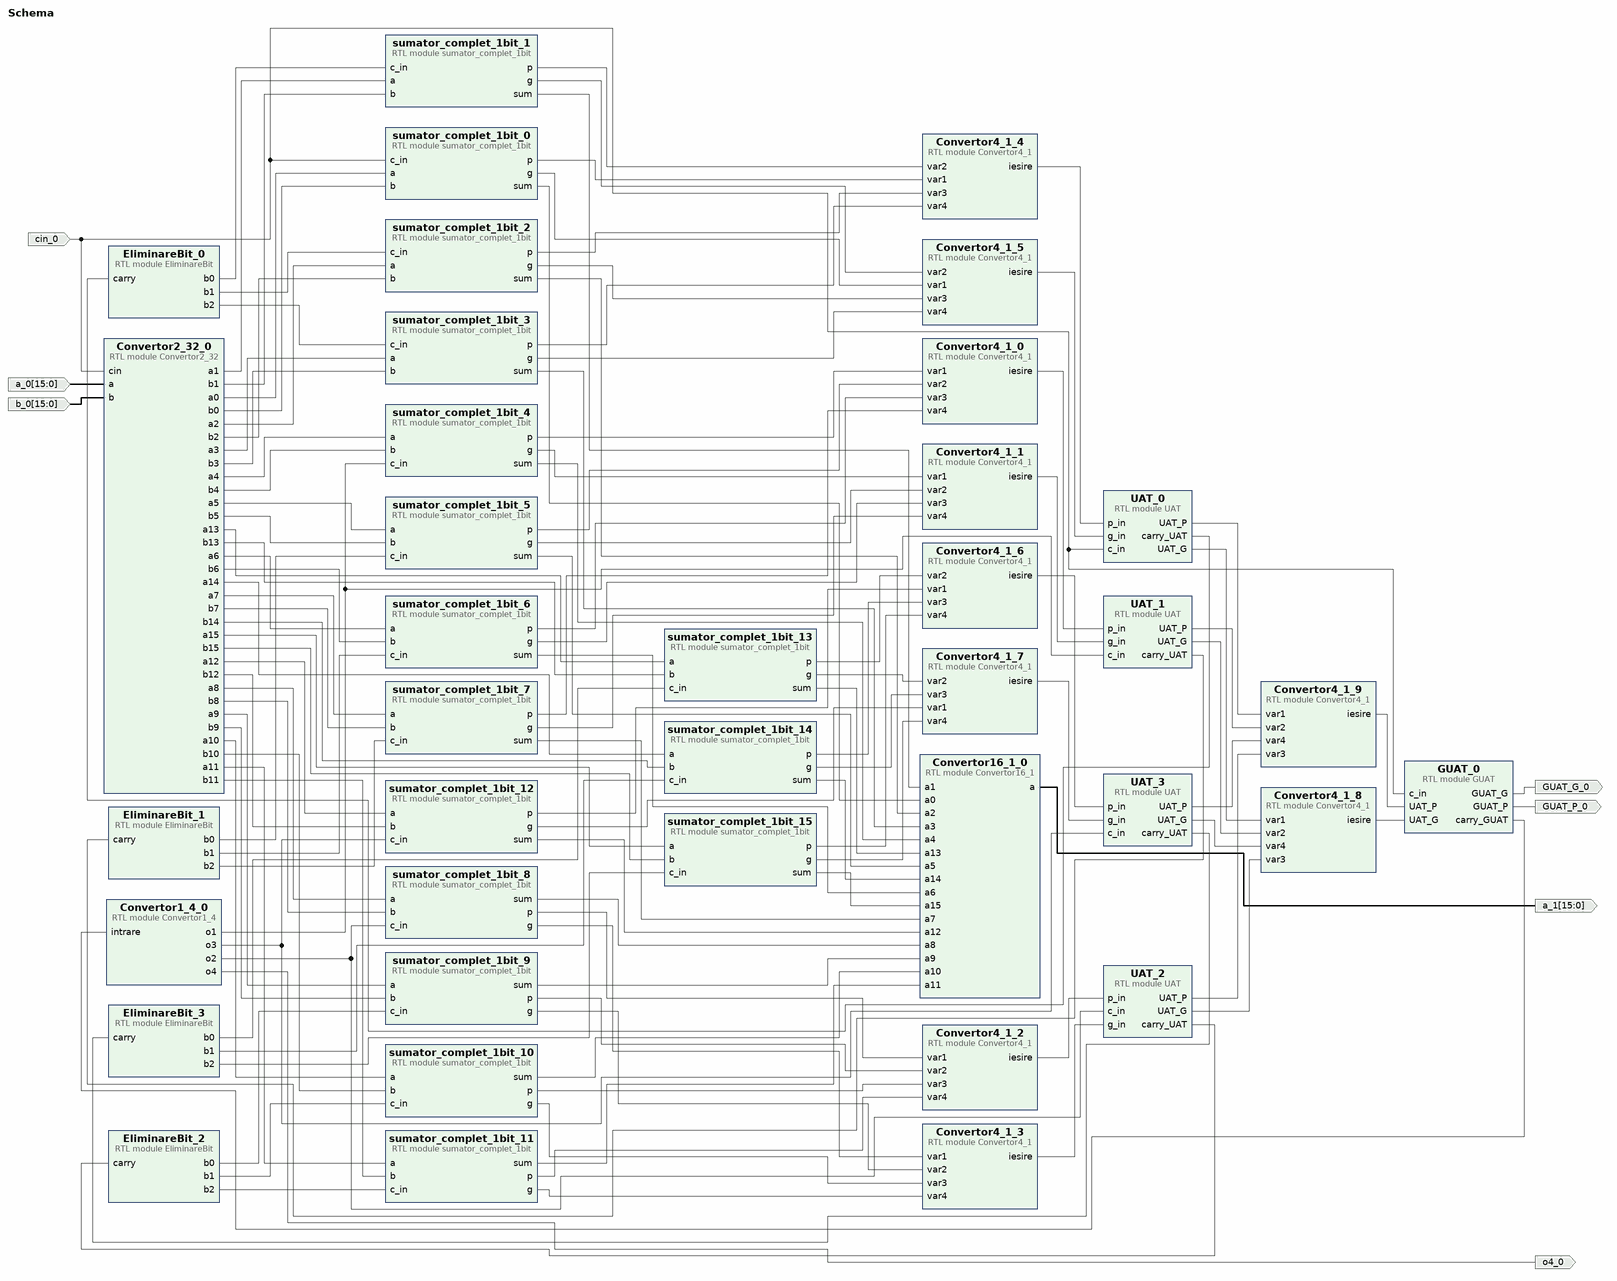
[diagram p0: block diagram of the top level]
# Vivado block design Schema, xc7a100tcsg324-1, Vivado 2020.2
create_bd_design Schema

create_bd_port -dir I -from 15 -to 0 a_0
create_bd_port -dir I -from 15 -to 0 b_0
create_bd_port -dir I cin_0
create_bd_port -dir O GUAT_G_0
create_bd_port -dir O GUAT_P_0
create_bd_port -dir O o4_0
create_bd_port -dir O -from 15 -to 0 a_1

create_bd_cell -type module -reference sumator_complet_1bit sumator_complet_1bit_0
create_bd_cell -type module -reference sumator_complet_1bit sumator_complet_1bit_1
create_bd_cell -type module -reference sumator_complet_1bit sumator_complet_1bit_2
create_bd_cell -type module -reference sumator_complet_1bit sumator_complet_1bit_3
create_bd_cell -type module -reference sumator_complet_1bit sumator_complet_1bit_4
create_bd_cell -type module -reference sumator_complet_1bit sumator_complet_1bit_5
create_bd_cell -type module -reference sumator_complet_1bit sumator_complet_1bit_6
create_bd_cell -type module -reference sumator_complet_1bit sumator_complet_1bit_7
create_bd_cell -type module -reference sumator_complet_1bit sumator_complet_1bit_8
create_bd_cell -type module -reference sumator_complet_1bit sumator_complet_1bit_9
create_bd_cell -type module -reference sumator_complet_1bit sumator_complet_1bit_10
create_bd_cell -type module -reference sumator_complet_1bit sumator_complet_1bit_11
create_bd_cell -type module -reference sumator_complet_1bit sumator_complet_1bit_12
create_bd_cell -type module -reference sumator_complet_1bit sumator_complet_1bit_13
create_bd_cell -type module -reference sumator_complet_1bit sumator_complet_1bit_14
create_bd_cell -type module -reference sumator_complet_1bit sumator_complet_1bit_15
create_bd_cell -type module -reference UAT UAT_0
create_bd_cell -type module -reference UAT UAT_1
create_bd_cell -type module -reference UAT UAT_2
create_bd_cell -type module -reference UAT UAT_3
create_bd_cell -type module -reference Convertor2_32 Convertor2_32_0
create_bd_cell -type module -reference GUAT GUAT_0
create_bd_cell -type module -reference Convertor16_1 Convertor16_1_0
create_bd_cell -type module -reference Convertor4_1 Convertor4_1_0
create_bd_cell -type module -reference Convertor4_1 Convertor4_1_1
create_bd_cell -type module -reference Convertor4_1 Convertor4_1_2
create_bd_cell -type module -reference Convertor4_1 Convertor4_1_3
create_bd_cell -type module -reference Convertor4_1 Convertor4_1_4
create_bd_cell -type module -reference Convertor4_1 Convertor4_1_5
create_bd_cell -type module -reference Convertor4_1 Convertor4_1_6
create_bd_cell -type module -reference Convertor4_1 Convertor4_1_7
create_bd_cell -type module -reference Convertor4_1 Convertor4_1_8
create_bd_cell -type module -reference Convertor4_1 Convertor4_1_9
create_bd_cell -type module -reference Convertor1_4 Convertor1_4_0
create_bd_cell -type module -reference EliminareBit EliminareBit_0
create_bd_cell -type module -reference EliminareBit EliminareBit_1
create_bd_cell -type module -reference EliminareBit EliminareBit_2
create_bd_cell -type module -reference EliminareBit EliminareBit_3

# ---- connections ----

connect_bd_net [get_bd_pins sumator_complet_1bit_4/p] [get_bd_pins Convertor4_1_0/var1]
connect_bd_net [get_bd_pins sumator_complet_1bit_5/p] [get_bd_pins Convertor4_1_0/var2]
connect_bd_net [get_bd_pins sumator_complet_1bit_6/p] [get_bd_pins Convertor4_1_0/var3]
connect_bd_net [get_bd_pins sumator_complet_1bit_7/p] [get_bd_pins Convertor4_1_0/var4]
connect_bd_net [get_bd_pins sumator_complet_1bit_4/g] [get_bd_pins Convertor4_1_1/var1]
connect_bd_net [get_bd_pins sumator_complet_1bit_5/g] [get_bd_pins Convertor4_1_1/var2]
connect_bd_net [get_bd_pins sumator_complet_1bit_6/g] [get_bd_pins Convertor4_1_1/var3]
connect_bd_net [get_bd_pins sumator_complet_1bit_7/g] [get_bd_pins Convertor4_1_1/var4]
connect_bd_net -net Convertor4_1_1_out [get_bd_pins Convertor4_1_1/iesire] [get_bd_pins UAT_1/g_in]
connect_bd_net -net Convertor4_1_0_out [get_bd_pins Convertor4_1_0/iesire] [get_bd_pins UAT_1/p_in]
connect_bd_net [get_bd_pins sumator_complet_1bit_8/p] [get_bd_pins Convertor4_1_2/var1]
connect_bd_net [get_bd_pins sumator_complet_1bit_9/p] [get_bd_pins Convertor4_1_2/var2]
connect_bd_net [get_bd_pins sumator_complet_1bit_10/p] [get_bd_pins Convertor4_1_2/var3]
connect_bd_net [get_bd_pins sumator_complet_1bit_11/p] [get_bd_pins Convertor4_1_2/var4]
connect_bd_net [get_bd_pins sumator_complet_1bit_8/g] [get_bd_pins Convertor4_1_3/var1]
connect_bd_net [get_bd_pins sumator_complet_1bit_9/g] [get_bd_pins Convertor4_1_3/var2]
connect_bd_net [get_bd_pins sumator_complet_1bit_10/g] [get_bd_pins Convertor4_1_3/var3]
connect_bd_net [get_bd_pins sumator_complet_1bit_11/g] [get_bd_pins Convertor4_1_3/var4]
connect_bd_net -net Convertor4_1_2_out [get_bd_pins Convertor4_1_2/iesire] [get_bd_pins UAT_2/p_in]
connect_bd_net -net Convertor4_1_3_out [get_bd_pins Convertor4_1_3/iesire] [get_bd_pins UAT_2/g_in]
connect_bd_net [get_bd_pins sumator_complet_1bit_0/p] [get_bd_pins Convertor4_1_4/var1]
connect_bd_net [get_bd_pins sumator_complet_1bit_1/p] [get_bd_pins Convertor4_1_4/var2]
connect_bd_net [get_bd_pins sumator_complet_1bit_2/p] [get_bd_pins Convertor4_1_4/var3]
connect_bd_net [get_bd_pins sumator_complet_1bit_3/p] [get_bd_pins Convertor4_1_4/var4]
connect_bd_net -net Convertor4_1_4_out [get_bd_pins Convertor4_1_4/iesire] [get_bd_pins UAT_0/p_in]
connect_bd_net [get_bd_pins sumator_complet_1bit_0/g] [get_bd_pins Convertor4_1_5/var1]
connect_bd_net [get_bd_pins sumator_complet_1bit_1/g] [get_bd_pins Convertor4_1_5/var2]
connect_bd_net [get_bd_pins sumator_complet_1bit_2/g] [get_bd_pins Convertor4_1_5/var3]
connect_bd_net [get_bd_pins sumator_complet_1bit_3/g] [get_bd_pins Convertor4_1_5/var4]
connect_bd_net -net Convertor4_1_5_out [get_bd_pins Convertor4_1_5/iesire] [get_bd_pins UAT_0/g_in]
connect_bd_net [get_bd_pins sumator_complet_1bit_12/p] [get_bd_pins Convertor4_1_6/var1]
connect_bd_net [get_bd_pins sumator_complet_1bit_13/p] [get_bd_pins Convertor4_1_6/var2]
connect_bd_net [get_bd_pins sumator_complet_1bit_14/p] [get_bd_pins Convertor4_1_6/var3]
connect_bd_net [get_bd_pins sumator_complet_1bit_15/p] [get_bd_pins Convertor4_1_6/var4]
connect_bd_net -net Convertor4_1_6_out [get_bd_pins Convertor4_1_6/iesire] [get_bd_pins UAT_3/p_in]
connect_bd_net [get_bd_pins sumator_complet_1bit_12/g] [get_bd_pins Convertor4_1_7/var1]
connect_bd_net [get_bd_pins sumator_complet_1bit_13/g] [get_bd_pins Convertor4_1_7/var2]
connect_bd_net [get_bd_pins sumator_complet_1bit_14/g] [get_bd_pins Convertor4_1_7/var3]
connect_bd_net [get_bd_pins sumator_complet_1bit_15/g] [get_bd_pins Convertor4_1_7/var4]
connect_bd_net -net Convertor4_1_7_out [get_bd_pins Convertor4_1_7/iesire] [get_bd_pins UAT_3/g_in]
connect_bd_net [get_bd_pins Convertor2_32_0/a0] [get_bd_pins sumator_complet_1bit_0/a]
connect_bd_net [get_bd_pins Convertor2_32_0/a1] [get_bd_pins sumator_complet_1bit_1/a]
connect_bd_net [get_bd_pins Convertor2_32_0/a2] [get_bd_pins sumator_complet_1bit_2/a]
connect_bd_net [get_bd_pins Convertor2_32_0/a3] [get_bd_pins sumator_complet_1bit_3/a]
connect_bd_net [get_bd_pins Convertor2_32_0/a4] [get_bd_pins sumator_complet_1bit_4/a]
connect_bd_net [get_bd_pins Convertor2_32_0/a5] [get_bd_pins sumator_complet_1bit_5/a]
connect_bd_net [get_bd_pins Convertor2_32_0/a6] [get_bd_pins sumator_complet_1bit_6/a]
connect_bd_net [get_bd_pins Convertor2_32_0/a7] [get_bd_pins sumator_complet_1bit_7/a]
connect_bd_net [get_bd_pins Convertor2_32_0/a8] [get_bd_pins sumator_complet_1bit_8/a]
connect_bd_net [get_bd_pins Convertor2_32_0/a9] [get_bd_pins sumator_complet_1bit_9/a]
connect_bd_net [get_bd_pins Convertor2_32_0/a10] [get_bd_pins sumator_complet_1bit_10/a]
connect_bd_net [get_bd_pins Convertor2_32_0/a11] [get_bd_pins sumator_complet_1bit_11/a]
connect_bd_net [get_bd_pins Convertor2_32_0/a12] [get_bd_pins sumator_complet_1bit_12/a]
connect_bd_net [get_bd_pins Convertor2_32_0/a13] [get_bd_pins sumator_complet_1bit_13/a]
connect_bd_net [get_bd_pins Convertor2_32_0/a14] [get_bd_pins sumator_complet_1bit_14/a]
connect_bd_net [get_bd_pins Convertor2_32_0/a15] [get_bd_pins sumator_complet_1bit_15/a]
connect_bd_net [get_bd_pins Convertor2_32_0/b0] [get_bd_pins sumator_complet_1bit_0/b]
connect_bd_net [get_bd_pins Convertor2_32_0/b1] [get_bd_pins sumator_complet_1bit_1/b]
connect_bd_net [get_bd_pins Convertor2_32_0/b2] [get_bd_pins sumator_complet_1bit_2/b]
connect_bd_net [get_bd_pins Convertor2_32_0/b3] [get_bd_pins sumator_complet_1bit_3/b]
connect_bd_net [get_bd_pins Convertor2_32_0/b4] [get_bd_pins sumator_complet_1bit_4/b]
connect_bd_net [get_bd_pins Convertor2_32_0/b5] [get_bd_pins sumator_complet_1bit_5/b]
connect_bd_net [get_bd_pins Convertor2_32_0/b6] [get_bd_pins sumator_complet_1bit_6/b]
connect_bd_net [get_bd_pins Convertor2_32_0/b7] [get_bd_pins sumator_complet_1bit_7/b]
connect_bd_net [get_bd_pins Convertor2_32_0/b8] [get_bd_pins sumator_complet_1bit_8/b]
connect_bd_net [get_bd_pins Convertor2_32_0/b9] [get_bd_pins sumator_complet_1bit_9/b]
connect_bd_net [get_bd_pins Convertor2_32_0/b10] [get_bd_pins sumator_complet_1bit_10/b]
connect_bd_net [get_bd_pins Convertor2_32_0/b11] [get_bd_pins sumator_complet_1bit_11/b]
connect_bd_net [get_bd_pins Convertor2_32_0/b12] [get_bd_pins sumator_complet_1bit_12/b]
connect_bd_net [get_bd_pins Convertor2_32_0/b13] [get_bd_pins sumator_complet_1bit_13/b]
connect_bd_net [get_bd_pins Convertor2_32_0/b14] [get_bd_pins sumator_complet_1bit_14/b]
connect_bd_net [get_bd_pins Convertor2_32_0/b15] [get_bd_pins sumator_complet_1bit_15/b]
connect_bd_net -net a_0_1 [get_bd_ports a_0] [get_bd_pins Convertor2_32_0/a]
connect_bd_net -net b_0_1 [get_bd_ports b_0] [get_bd_pins Convertor2_32_0/b]
connect_bd_net -net cin_0_1 [get_bd_ports cin_0] \
  [get_bd_pins Convertor2_32_0/cin] [get_bd_pins UAT_0/c_in] [get_bd_pins sumator_complet_1bit_0/c_in] \
  [get_bd_pins GUAT_0/c_in]
connect_bd_net [get_bd_pins GUAT_0/GUAT_G] [get_bd_ports GUAT_G_0]
connect_bd_net [get_bd_pins GUAT_0/GUAT_P] [get_bd_ports GUAT_P_0]
connect_bd_net [get_bd_pins GUAT_0/carry_GUAT] [get_bd_pins Convertor1_4_0/intrare]
connect_bd_net [get_bd_pins Convertor1_4_0/o4] [get_bd_ports o4_0]
connect_bd_net [get_bd_pins Convertor1_4_0/o1] [get_bd_pins UAT_1/c_in] [get_bd_pins sumator_complet_1bit_4/c_in]
connect_bd_net [get_bd_pins Convertor1_4_0/o2] [get_bd_pins UAT_2/c_in] [get_bd_pins sumator_complet_1bit_8/c_in]
connect_bd_net [get_bd_pins Convertor1_4_0/o3] [get_bd_pins UAT_3/c_in] [get_bd_pins sumator_complet_1bit_12/c_in]
connect_bd_net [get_bd_pins sumator_complet_1bit_0/sum] [get_bd_pins Convertor16_1_0/a0]
connect_bd_net [get_bd_pins sumator_complet_1bit_1/sum] [get_bd_pins Convertor16_1_0/a1]
connect_bd_net [get_bd_pins sumator_complet_1bit_2/sum] [get_bd_pins Convertor16_1_0/a2]
connect_bd_net [get_bd_pins sumator_complet_1bit_3/sum] [get_bd_pins Convertor16_1_0/a3]
connect_bd_net [get_bd_pins sumator_complet_1bit_4/sum] [get_bd_pins Convertor16_1_0/a4]
connect_bd_net [get_bd_pins sumator_complet_1bit_5/sum] [get_bd_pins Convertor16_1_0/a5]
connect_bd_net [get_bd_pins sumator_complet_1bit_6/sum] [get_bd_pins Convertor16_1_0/a6]
connect_bd_net [get_bd_pins sumator_complet_1bit_7/sum] [get_bd_pins Convertor16_1_0/a7]
connect_bd_net [get_bd_pins sumator_complet_1bit_8/sum] [get_bd_pins Convertor16_1_0/a8]
connect_bd_net [get_bd_pins sumator_complet_1bit_9/sum] [get_bd_pins Convertor16_1_0/a9]
connect_bd_net [get_bd_pins sumator_complet_1bit_10/sum] [get_bd_pins Convertor16_1_0/a10]
connect_bd_net [get_bd_pins sumator_complet_1bit_11/sum] [get_bd_pins Convertor16_1_0/a11]
connect_bd_net [get_bd_pins sumator_complet_1bit_12/sum] [get_bd_pins Convertor16_1_0/a12]
connect_bd_net [get_bd_pins sumator_complet_1bit_13/sum] [get_bd_pins Convertor16_1_0/a13]
connect_bd_net [get_bd_pins sumator_complet_1bit_14/sum] [get_bd_pins Convertor16_1_0/a14]
connect_bd_net [get_bd_pins sumator_complet_1bit_15/sum] [get_bd_pins Convertor16_1_0/a15]
connect_bd_net [get_bd_pins Convertor16_1_0/a] [get_bd_ports a_1]
connect_bd_net [get_bd_pins UAT_0/carry_UAT] [get_bd_pins EliminareBit_0/carry]
connect_bd_net [get_bd_pins EliminareBit_0/b0] [get_bd_pins sumator_complet_1bit_1/c_in]
connect_bd_net [get_bd_pins EliminareBit_0/b1] [get_bd_pins sumator_complet_1bit_2/c_in]
connect_bd_net [get_bd_pins EliminareBit_0/b2] [get_bd_pins sumator_complet_1bit_3/c_in]
connect_bd_net [get_bd_pins UAT_1/carry_UAT] [get_bd_pins EliminareBit_1/carry]
connect_bd_net [get_bd_pins EliminareBit_1/b0] [get_bd_pins sumator_complet_1bit_5/c_in]
connect_bd_net [get_bd_pins EliminareBit_1/b1] [get_bd_pins sumator_complet_1bit_6/c_in]
connect_bd_net [get_bd_pins EliminareBit_1/b2] [get_bd_pins sumator_complet_1bit_7/c_in]
connect_bd_net [get_bd_pins EliminareBit_2/b0] [get_bd_pins sumator_complet_1bit_9/c_in]
connect_bd_net [get_bd_pins EliminareBit_2/b1] [get_bd_pins sumator_complet_1bit_10/c_in]
connect_bd_net [get_bd_pins EliminareBit_2/b2] [get_bd_pins sumator_complet_1bit_11/c_in]
connect_bd_net [get_bd_pins EliminareBit_3/b0] [get_bd_pins sumator_complet_1bit_13/c_in]
connect_bd_net [get_bd_pins EliminareBit_3/b1] [get_bd_pins sumator_complet_1bit_14/c_in]
connect_bd_net [get_bd_pins EliminareBit_3/b2] [get_bd_pins sumator_complet_1bit_15/c_in]
connect_bd_net [get_bd_pins UAT_2/carry_UAT] [get_bd_pins EliminareBit_2/carry]
connect_bd_net [get_bd_pins UAT_3/carry_UAT] [get_bd_pins EliminareBit_3/carry]
connect_bd_net [get_bd_pins UAT_0/UAT_G] [get_bd_pins Convertor4_1_8/var1]
connect_bd_net [get_bd_pins UAT_1/UAT_G] [get_bd_pins Convertor4_1_8/var2]
connect_bd_net [get_bd_pins UAT_2/UAT_G] [get_bd_pins Convertor4_1_8/var3]
connect_bd_net [get_bd_pins UAT_3/UAT_G] [get_bd_pins Convertor4_1_8/var4]
connect_bd_net -net Convertor4_1_8_out [get_bd_pins Convertor4_1_8/iesire] [get_bd_pins GUAT_0/UAT_G]
connect_bd_net [get_bd_pins UAT_0/UAT_P] [get_bd_pins Convertor4_1_9/var1]
connect_bd_net [get_bd_pins UAT_1/UAT_P] [get_bd_pins Convertor4_1_9/var2]
connect_bd_net [get_bd_pins UAT_2/UAT_P] [get_bd_pins Convertor4_1_9/var3]
connect_bd_net [get_bd_pins UAT_3/UAT_P] [get_bd_pins Convertor4_1_9/var4]
connect_bd_net -net Convertor4_1_9_out [get_bd_pins Convertor4_1_9/iesire] [get_bd_pins GUAT_0/UAT_P]

validate_bd_design
save_bd_design
